# EAGLE schematic sensor (EAGLE 9.6.2)
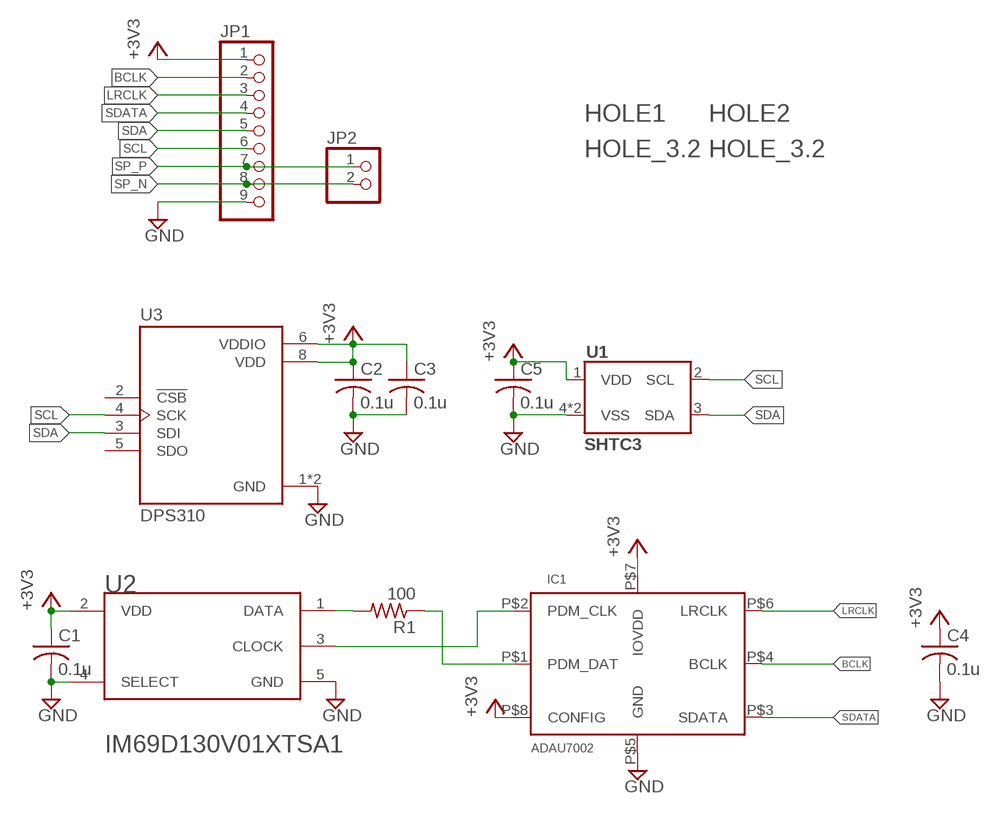
[diagram p0: schematic, sheet 1]

## Parts
C1  0.1u  C-2012  [2012-C]
C2  0.1u  C-2012  [2012-C]
C3  0.1u  C-2012  [2012-C]
C4  0.1u  C-2012  [2012-C]
C5  0.1u  C-2012  [2012-C]
HOLE1  HOLE_3.2  [HOLE_3.2]
HOLE2  HOLE_3.2  [HOLE_3.2]
IC1  ADAU7002  [WLCSP2X4]
JP1  PINHD-1X9  [1X09]
JP2  PINHD-1X2  [1X02]
R1  100  R-2012  [2012-R]
U1  SHTC3  [SHTC3]
U2  IM69D130  [IM69D130]
U3  DPS310  [XDCR_DPS310]

## Nets
+3V3: C1.1 C2.1 C3.1 C4.1 C5.1 IC1.P$7(IOVDD) IC1.P$8(CONFIG) JP1.1 U1.1(VDD) U2.2(VDD) U3.6(VDDIO) U3.8(VDD)
BCLK: IC1.P$4(BCLK) JP1.2
GND: C1.2 C2.2 C3.2 C4.2 C5.2 IC1.P$5(GND) JP1.9 U1.4(VSS) U1.5(VSS) U2.4(SELECT) U2.5(GND) U3.1(GND) U3.7(GND)
LRCLK: IC1.P$6(LRCLK) JP1.3
N$1: R1.2 U2.1(DATA)
N$2: IC1.P$1(PDM_DAT) R1.1
N$3: IC1.P$2(PDM_CLK) U2.3(CLOCK)
SCL: JP1.6 U1.2(SCL) U3.4(SCK)
SDA: JP1.5 U1.3(SDA) U3.3(SDI)
SDATA: IC1.P$3(SDATA) JP1.4
SP_N: JP1.8 JP2.2
SP_P: JP1.7 JP2.1
Unconnected: U3.2(!CSB) U3.5(SDO)

## Library data of the parts
C1-C5 = Passive_Robotech:C
HOLE1 HOLE2 = Document_Robotech:HOLE_3.2: Robotech hole diameter 3.2mm tDoc washer(diameter 8mm) bDoc spacer(diameter 6mm)
IC1 = rezzonics:ADAU7002
JP1 = pinhead:PINHD-1X9: PIN HEADER
JP2 = pinhead:PINHD-1X2: PIN HEADER
R1 = Passive_Robotech:R
U1 = SparkFun-Sensors:SHTC3: Sensirion SHTC3 Humidity Sensor The SHTC3 is a digital humidity and temperature sensor designed especially for battery-driven high-volume consumer electronics applications.; PROD_ID: IC-14840
U2 = IC_Robotech:IM69D130: MIC MEMS DIGITAL OMNI 95DB
U3 = IC_Robotech:DPS310: P-Sensor 1.2 Bar I2C&SPI Barom. Check availability <https://pricing.snapeda.com/parts/DPS310/Infineon%20Technologies/view-part?ref=eda>; AVAILABILITY: In Stock; DESCRIPTION: Pressure Sensor 4.35PSI ~ 17.4PSI (30kPa ~ 120kPa) Vented Gauge - 24 b 8-VFLGA; MF: Infineon Technologies; MP: DPS310; PACKAGE: VFLGA-8 Infineon Technologies; PRICE: None; PURCHASE-URL: https://pricing.snapeda.com/search/part/DPS310/?ref=eda